# Altium project Eingangsstufe.PrjPcb
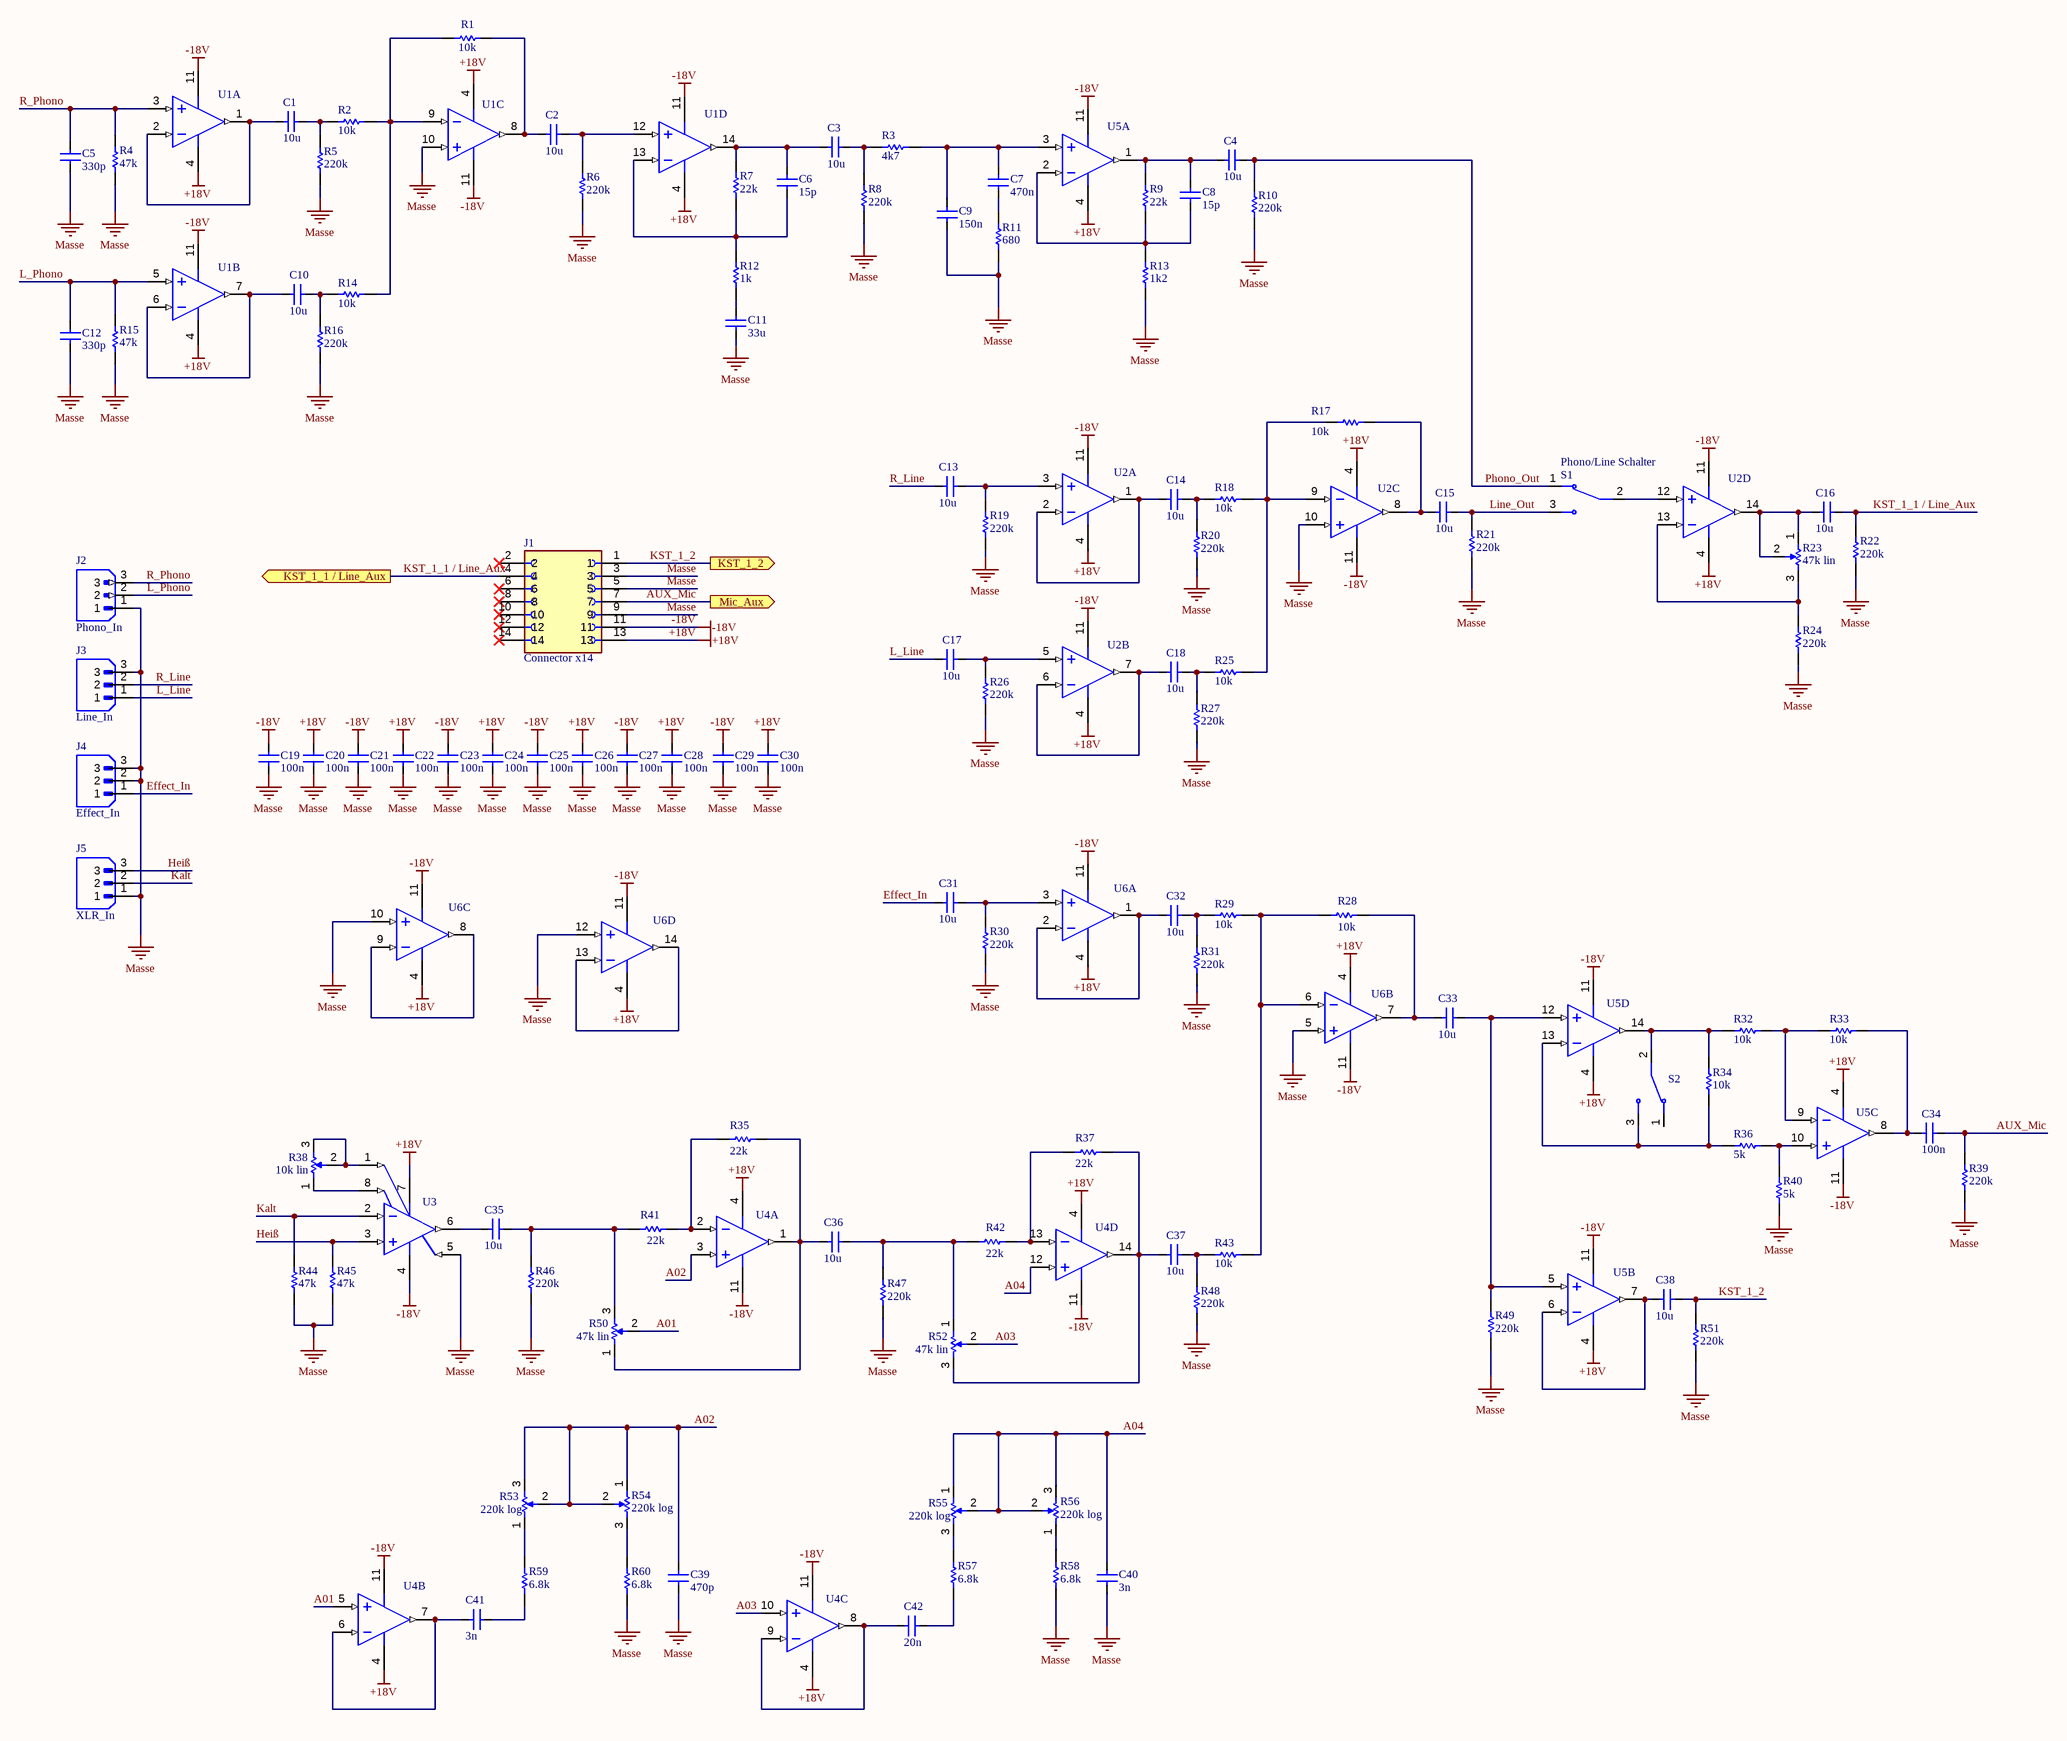
[diagram p0: Eingangsstufe.SchDoc]
1 sheet, 115 parts. Net scope: flat (ports and power ports of the same name join across sheets).
Board file: Eingangsstufe.PcbDoc

## Sheet Eingangsstufe.SchDoc
size A2

### Parts
C1  10u  [0805]
C2  10u  [0805]
C3  10u  [0805]
C4  10u  [0805]
C5  330p  [0805]
C6  15p  [0805]
C7  470n  [0805]
C8  15p  [0805]
C9  150n  [0805]
C10  10u  [0805]
C11  33u  [0805]
C12  330p  [0805]
C13  10u  [0805]
C14  10u  [0805]
C15  10u  [0805]
C16  10u  [0805]
C17  10u  [0805]
C18  10u  [0805]
C19  100n  [0805]
C20  100n  [0805]
C21  100n  [0805]
C22  100n  [0805]
C23  100n  [0805]
C24  100n  [0805]
C25  100n  [0805]
C26  100n  [0805]
C27  100n  [0805]
C28  100n  [0805]
C29  100n  [0805]
C30  100n  [0805]
C31  10u  [0805]
C32  10u  [0805]
C33  10u  [0805]
C34  100n  [0805]
C35  10u  [0805]
C36  10u  [0805]
C37  10u  [0805]
C38  10u  [0805]
C39  470p  [0805]
C40  3n  [0805]
C41  3n  [0805]
C42  20n  [0805]
J1  Connector x14  [Connector x14]
J2  Phono_In  [Connector x3]
J3  Line_In  [Connector x3]
J4  Effect_In  [Connector x3]
J5  XLR_In  [Connector x3]
R1  10k  [0805]
R2  10k  [0805]
R3  4k7  [0805]
R4  47k  [0805]
R5  220k  [0805]
R6  220k  [0805]
R7  22k  [0805]
R8  220k  [0805]
R9  22k  [0805]
R10  220k  [0805]
R11  680  [0805]
R12  1k  [0805]
R13  1k2  [0805]
R14  10k  [0805]
R15  47k  [0805]
R16  220k  [0805]
R17  10k  [0805]
R18  10k  [0805]
R19  220k  [0805]
R20  220k  [0805]
R21  220k  [0805]
R22  220k  [0805]
R23  47k lin  [Connector x3]
R24  220k  [0805]
R25  10k  [0805]
R26  220k  [0805]
R27  220k  [0805]
R28  10k  [0805]
R29  10k  [0805]
R30  220k  [0805]
R31  220k  [0805]
R32  10k  [0805]
R33  10k  [0805]
R34  10k  [0805]
R35  22k  [0805]
R36  5k  [0805]
R37  22k  [0805]
R38  10k lin  [Connector x3]
R39  220k  [0805]
R40  5k  [0805]
R41  22k  [0805]
R42  22k  [0805]
R43  10k  [0805]
R44  47k  [0805]
R45  47k  [0805]
R46  220k  [0805]
R47  220k  [0805]
R48  220k  [0805]
R49  220k  [0805]
R50  47k lin  [Connector x3]
R51  220k  [0805]
R52  47k lin  [Connector x3]
R53  220k log  [Connector x3]
R54  220k log  [Connector x3]
R55  220k log  [Connector x3]
R56  220k log  [Connector x3]
R57  6.8k  [0805]
R58  6.8k  [0805]
R59  6.8k  [0805]
R60  6.8k  [0805]
S1  Phono/Line Schalter  [Connector x3]
S2  Schalter Buchsenleiste  [Connector x3]  (value not drawn)
U1  OPA4134UA  [DIP14 IC Socket]  (value not drawn)  (parts A,B,C,D of 4)
U2  OPA4134UA  [DIP14 IC Socket]  (value not drawn)  (parts A,B,C,D of 4)
U3  INA128U  [INA 128]  (value not drawn)
U4  OPA4134UA  [DIP14 IC Socket]  (value not drawn)  (parts A,B,C,D of 4)
U5  OPA4134UA  [DIP14 IC Socket]  (value not drawn)  (parts A,B,C,D of 4)
U6  OPA4134UA  [DIP14 IC Socket]  (value not drawn)  (parts A,B,C,D of 4)

### Ports
KST_1_1 / Line_Aux (out), KST_1_2 (out), Mic_Aux (out)

### Nets
+18V: C20.2 C22.2 C24.2 C26.2 C28.2 C30.2 J1.13 U1.4(V+) U2.4(V+) U3.7(V+) U4.4(V+) U5.4(V+) U6.4(V+)
-18V: C19.2 C21.2 C23.2 C25.2 C27.2 C29.2 J1.11 U1.11(V-) U2.11(V-) U3.4(V-) U4.11(V-) U5.11(V-) U6.11(V-)
Masse: C5.1 C9.1 C11.1 C12.1 C19.1 C20.1 C21.1 C22.1 C23.1 C24.1 C25.1 C26.1 C27.1 C28.1 C29.1 C30.1 C39.1 C40.2 J1.3 J1.5 J1.9 J2.1 J3.3 J4.2 J4.3 J5.1 R4.1 R5.2 R6.2 R8.1 R10.1 R11.1 R13.1 R15.1 R16.2 R19.1 R20.2 R21.1 R22.1 R24.1 R26.1 R27.2 R30.1 R31.2 R39.1 R40.1 R44.1 R45.1 R46.1 R47.1 R48.2 R49.1 R51.1 R58.2 R60.1 U1.10(IN_C+) U2.10(IN_C+) U3.5(REF) U6.5(IN_B+) U6.10(IN_C+) U6.12(IN_D+)
A01: R50.2 U4.5(IN_B+)
A02: C39.2 R53.2 R53.3 R54.1 R54.2 U4.3(IN_A+)
A03: R52.2 U4.10(IN_C+)
A04: C40.1 R55.1 R55.2 R56.2 R56.3 U4.12(IN_D+)
AUX_Mic: C34.2 J1.7 R39.2 ; port Mic_Aux
Effect_In: C31.1 J4.1
Heiß: J5.3 R45.2 U3.3(VIN+)
Kalt: J5.2 R44.2 U3.2(VIN-)
KST_1_1 / Line_Aux: C16.2 J1.4 R22.2 ; port KST_1_1 / Line_Aux
KST_1_2: C38.2 J1.1 R51.2 ; port KST_1_2
L_Line: C17.2 J3.1
L_Phono: C12.2 J2.2 R15.2 U1.5(IN_B+)
Line_Out: C15.1 R21.2 S1.3
Phono_Out: C4.1 R10.2 S1.1
R_Line: C13.1 J3.2
R_Phono: C5.2 J2.3 R4.2 U1.3(IN_A+)
NetC1_1: C1.1 R2.2 R5.1
NetC1_2: C1.2 U1.1(OUT_A) U1.2(IN_A-)
NetC2_1: C2.1 R6.1 U1.12(IN_D+)
NetC2_2: C2.2 R1.2 U1.8(OUT_C)
NetC3_1: C3.1 R3.2 R8.2
NetC3_2: C3.2 C6.2 R7.2 U1.14(OUT_D)
NetC4_2: C4.2 C8.2 R9.2 U5.1(OUT_A)
NetC6_1: C6.1 R7.1 R12.2 U1.13(IN_D-)
NetC7_1: C7.1 R11.2
NetC7_2: C7.2 C9.2 R3.1 U5.3(IN_A+)
NetC8_1: C8.1 R9.1 R13.2 U5.2(IN_A-)
NetC10_1: C10.1 R14.2 R16.1
NetC10_2: C10.2 U1.6(IN_B-) U1.7(OUT_B)
NetC11_2: C11.2 R12.1
NetC13_2: C13.2 R19.2 U2.3(IN_A+)
NetC14_1: C14.1 R18.2 R20.1
NetC14_2: C14.2 U2.1(OUT_A) U2.2(IN_A-)
NetC15_2: C15.2 R17.2 U2.8(OUT_C)
NetC16_1: C16.1 R23.1 R23.2 U2.14(OUT_D)
NetC17_1: C17.1 R26.2 U2.5(IN_B+)
NetC18_1: C18.1 R25.2 R27.1
NetC18_2: C18.2 U2.6(IN_B-) U2.7(OUT_B)
NetC31_2: C31.2 R30.2 U6.3(IN_A+)
NetC32_1: C32.1 R29.2 R31.1
NetC32_2: C32.2 U6.1(OUT_A) U6.2(IN_A-)
NetC33_1: C33.1 R28.2 U6.7(OUT_B)
NetC33_2: C33.2 R49.2 U5.5(IN_B+) U5.12(IN_D+)
NetC34_1: C34.1 R33.2 U5.8(OUT_C)
NetC35_1: C35.1 U3.6(VO)
NetC35_2: C35.2 R41.1 R46.2 R50.3
NetC36_1: C36.1 R35.2 R50.1 U4.1(OUT_A)
NetC36_2: C36.2 R42.1 R47.2 R52.1
NetC37_1: C37.1 R43.2 R48.1
NetC37_2: C37.2 R37.2 R52.3 U4.14(OUT_D)
NetC38_1: C38.1 U5.6(IN_B-) U5.7(OUT_B)
NetC41_1: C41.1 U4.6(IN_B-) U4.7(OUT_B)
NetC41_2: C41.2 R59.1
NetC42_1: C42.1 R57.2
NetC42_2: C42.2 U4.8(OUT_C) U4.9(IN_C-)
NetR1_1: R1.1 R2.1 R14.1 U1.9(IN_C-)
NetR17_1: R17.1 R18.1 R25.1 U2.9(IN_C-)
NetR23_3: R23.3 R24.2 U2.13(IN_D-)
NetR28_1: R28.1 R29.1 R43.1 U6.6(IN_B-)
NetR32_1: R32.1 R34.2 S2.2 U5.14(OUT_D)
NetR32_2: R32.2 R33.1 U5.9(IN_C-)
NetR34_1: R34.1 R36.1 S2.3 U5.13(IN_D-)
NetR35_1: R35.1 R41.2 U4.2(IN_A-)
NetR36_2: R36.2 R40.2 U5.10(IN_C+)
NetR37_1: R37.1 R42.2 U4.13(IN_D-)
NetR38_1: R38.1 U3.8(RG)
NetR38_2: R38.2 R38.3 U3.1(RG)
NetR53_1: R53.1 R59.2
NetR54_3: R54.3 R60.2
NetR55_3: R55.3 R57.1
NetR56_1: R56.1 R58.1
NetS1_2: S1.2 U2.12(IN_D+)
NetU6_8: U6.8(OUT_C) U6.9(IN_C-)
NetU6_13: U6.13(IN_D-) U6.14(OUT_D)

Not connected (* = marked no-connect by the designer): J1 2* 6* 8* 10* 12* 14*; S2 1

### Notes on the sheet
- THIS DOCUMENT AND THE DATA DISCLOSED HEREIN OR
- HEREWITH IS THE PROPERTY OF ALTIUM LIMITED AND MAY
- DWG NO:
- REVISION
- REV:
- DESCRIPTION
- DATE
- APPROVED
- BE FREELY DISTRIBUTED IN WHOLE. NO RIGHTS ARE
- RESERVED OR EXPRESS OR IMPLIED WARANTEE GIVEN.
- ENG:
- APPROVALS
- PROJECT
- DSN:
- CHK:
- REFERENCE DOCUMENTS
- PROJECT REVISION:
- TITLE
- DOCUMENT REVISION:
- DESIGN ITEM:
- BOM:
- FAB DWG:
- PCB DWG:
- ASSY DWG:
- SCALE:
- A3
- SIZE
- CAGE CODE
- FILE NAME
- DWG NO.
- SHEET
- OF
- REV

### Library data of the parts
C1-C42 = 0805 Kondensator
  C1-C4 C10 C13-C18 C31-C33 C35-C38: Value: 10u
  C5 C12: Value: 330p
  C6 C8: Value: 15p
  C7: Value: 470n
  C9: Value: 150n
  C11: Value: 33u
  C19-C30 C34: Value: 100n
  C39: Value: 470p
  C40 C41: Value: 3n
  C42: Value: 20n
J1 = Connector x14: 14 Position Header Connector Through Hole; MF: Sullins Connector; MP: SFH11-PBPC-D07-ST-BK; Value: *; Check_prices: https://www.snapeda.com/parts/SFH11-PBPC-D07-ST-BK/Sullins%20Connector%20Solutions/view-part/851415/?ref=eda; Availability: Warning; Package: None; SnapEDA_Link: https://www.snapeda.com/parts/SFH11-PBPC-D07-ST-BK/Sullins%20Connector%20Solutions/view-part/851415/?ref=snap; Purchase-URL: https://pricing.snapeda.com/search/part/SFH11-PBPC-D07-ST-BK/?ref=eda; Price: None; System: Connector
J2-J5 = Connector x3: Connector Header Through Hole 3 position 0.100 (2.54mm); MF: JST Sales; MP: B3B-XH-A; SnapEDA_Link: https://www.snapeda.com/parts/B3B-XH-A/JST+Sales+America+Inc./view-part/?ref=snap; Package: None; Value: *; Check_prices: https://www.snapeda.com/parts/B3B-XH-A/JST+Sales+America+Inc./view-part/?ref=eda
R1-R22 R24-R37 R39-R49 R51 R57-R60 = 0805 Widerstand
  R1 R2 R14 R17 R18 R25 R28 R29 R32-R34 R43: Value: 10k
  R3: Value: 4k7
  R4 R15 R44 R45: Value: 47k
  R5 R6 R8 R10 R16 R19-R22 R24 R26 R27 R30 R31 R39 R46-R49 R51: Value: 220k
  R7 R9 R35 R37 R41 R42: Value: 22k
  R11: Value: 680
  R12: Value: 1k
  R13: Value: 1k2
  R36 R40: Value: 5k
  R57-R60: Value: 6.8k
R23 R38 R50 R52-R56 = Potentiometer Buchsenleiste: Potentiometer
  R23 R50 R52: Value: 47k lin
  R38: Value: 10k lin
  R53-R56: Value: 220k log
S1 S2 = Schalter Buchsenleiste: Toggle Switch SPDT Through Hole; MP: 100SP1T1B4M2QE; Package: None; Price: None; Value: *; Availability: Unavailable
U1 U2 U4-U6 = SOIC OPA4134UA: SoundPlus(TM) High Performance Audio Operational Amplifier, 5 to 36 V, -55 to 125 degC, 14-pin SOIC (D14), Green (RoHS & no Sb/Br); Manufacturer: Texas Instruments; Vmax(V): 36; Number of Channels: 4; Iq per channel(Max)(mA): 5; GBW(Typ)(MHz): 8; DatasheetVersion: SBOS058; ComponentLink2URL: http://www.ti.com/general/docs/lit/getliterature.tsp?genericPartNumber=OPA4134&fileType=pdf; ComponentLink1URL: http://www.ti.com/; PackageDescription: 14-Pin Plastic Small Outline, Body 8.65 x 3.9 mm, Pitch 1.27 mm; SubFamily: Audio Operational Amplifier; Vmin(V): 5; ComponentLink2Description: Datasheet; PackageVersion: 4040047-5/M, 06/2011; Code_JEDEC: MS-012; PackageReference: D0014A; ComponentLink1Description: Manufacturer URL; Vn at Flatband(Typ)(nV/rtHz): 8; Eco-Plan: Green (RoHS & no Sb/Br); Mounting Technology: Surface Mount; ComponentLink3URL: http://www.ti.com/lit/ml/mpds177g/mpds177g.pdf; PartNumber: OPA4134UA; ComponentLink3Description: Package Specification
U3 = INA 128: Precision, Low Power Instrumentation Amplifier, -40 to 85 degC, 8-pin SOIC (D8), Green (RoHS & no Sb/Br); Manufacturer: Texas Instruments; Gain(V/V): 1 to 10000; Noise at 1kHz(Typ)(nV/rt(Hz)): 8; Number of Channels: 1; Vs(Max)(V): 36; Vs(Min)(V): 4.5; Input Offset (+/-)(Max)(uV): 50; Input Bias Current (+/-)(Max)(nA): 5; Non-Linearity (+/-)(Max)(%): 0.002; CMRR(Min)(dB): 120; Input Offset Drift (+/-)(Max)(uV/Degrees Celsius): 0.5; SubFamily: Dual Supply; Quiescent Current (+/-)(Typ)(mA): 0.7; ComponentLink1URL: http://www.ti.com/; PackageVersion: 4040047-3/M, 06/2011; PackageDescription: 8-Pin Plastic Small Outline, Body 4.9 x 3.9 mm, Pitch 1.27 mm; Mounting Technology: Surface Mount; ComponentLink3URL: http://www.ti.com/litv/pdf/msoi002j; ComponentLink3Description: Package Specification; PackageReference: D0008A; PartNumber: INA128U; Code_JEDEC: MS-012; ComponentLink2Description: Datasheet; Eco-Plan: Green (RoHS & no Sb/Br); DatasheetVersion: SBOS051B; ComponentLink2URL: http://www.ti.com/general/docs/lit/getliterature.tsp?genericPartNumber=INA128&fileType=pdf; ComponentLink1Description: Manufacturer URL